# EAGLE design precVref (EAGLE 6.1)
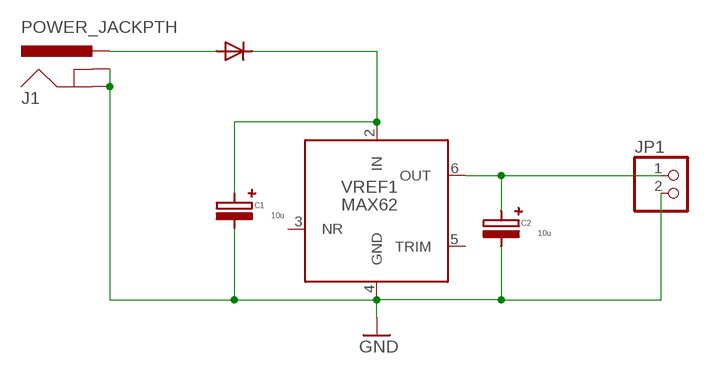
[diagram p0: schematic, sheet 1]

## Parts
C1  10u  C-POL1.5/5  [CPOL1,5/5]
C2  10u  C-POL1.5/5  [CPOL1,5/5]
D1  D7/2X5  [DO-41]
J1  POWER_JACKPTH  [POWER_JACK_PTH]
JP1  PINHD-1X2  [1X02]
VREF1  MAX62  [SOIC-8]

## Nets
GND: C1.P$1(NEG) C2.P$1(NEG) J1.GND J1.GNDBREAK JP1.2 VREF1.4(GND)
N$1: C1.P$2(POS) D1.CATHODE VREF1.2(IN)
N$2: C2.P$2(POS) JP1.1 VREF1.6(OUT)
N$3: D1.ANODE J1.PWR
Unconnected: VREF1.3(NR) VREF1.5(TRIM)

## Library data of the parts
C1 C2 = hightower:C-POL
D1 = hightower:D
J1 = SparkFun:POWER_JACK: Power Jack This is the standard 5.5mm barrel jack for power. The PTH is the most common, proven, reliable, footprint. All others are experimental. The Slot footprint only works if the mill layer is transmitted to the PCB fab house so be warned. Spark Fun Electronics SKU : PRT-00119. Mating wall wart : TOL-00298 (and others)
JP1 = pinhead:PINHD-1X2: PIN HEADER
VREF1 = hightower:MAX62**

## Board
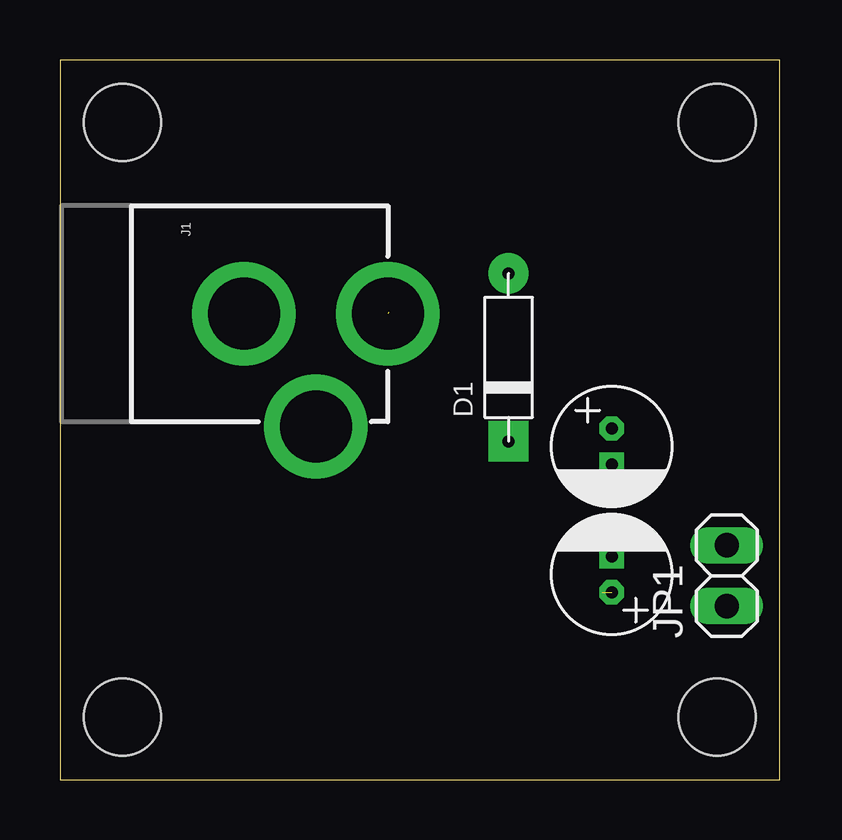
[diagram p1: board, top side]
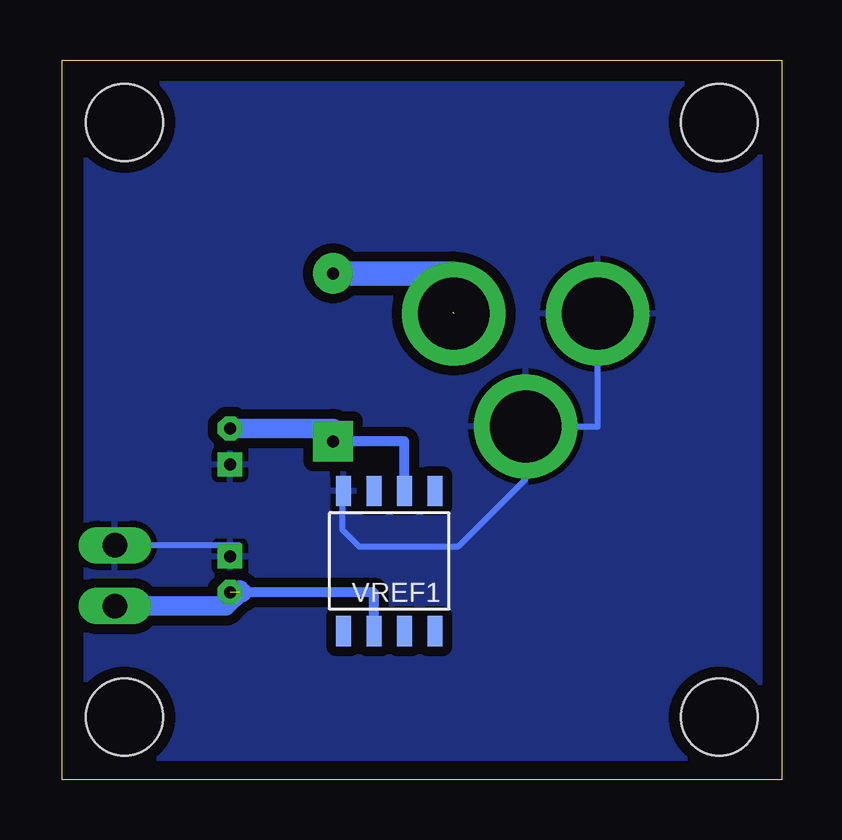
[diagram p2: board, bottom side, seen from below]

Size 30 x 30 mm. Coordinates in mm from the lower left corner, seen from the top.
Outline: 0,0 30,0 30,30 0,30 0,0
Copper layers (1*16): Top 0.035mm / dielectric 1.5mm / Bottom 0.035mm
Design rules: minimum track width 10mil, minimum drill 8mil, track to track 8mil, track to pad 8mil, pad to pad 8mil, via to via 8mil, smd to smd 8mil, copper to edge 20mil, drill to drill 8mil, minimum pad ring 10mil, minimum via ring 8mil, stop-mask expansion 4mil, vias tented up to drill 0mil, thermal gap 10mil
Holes 3.2 mm at 2.6,2.6 27.4,2.6 2.6,27.4 27.4,27.4

### Footprints (pad centres in the part's own frame; a part is rotated, then mirrored left to right if it is on the bottom)
CPOL1,5/5 = drill 0.5 square: P$1 -0.75,0 | drill 0.5 octagon: P$2 0.75,0
DO-41 = drill 0.5 pad 1.676: ANODE 3.5,0 | drill 0.5 pad 1.676 square: CATHODE -3.5,0
POWER_JACK_PTH = drill 2.997 pad 4.318: GND 0,7.7; GNDBREAK 4.7,10.7; PWR 0,13.7
1X02 = drill 1.016 long: 1 -1.27,0; 2 1.27,0
SOIC-8 = smd 0.635 x 1.27: 1 -1.905,-2.921; 2 -0.635,-2.921; 3 0.635,-2.921; 4 1.905,-2.921; 5 1.905,2.921; 6 0.635,2.921; 7 -0.635,2.921; 8 -1.905,2.921

### Placement (x,y rotation side)
C1  23,13.89 90 top
C2  23,8.56 270 top
D1  18.7,17.6 90 top
J1  -0.03,19.42 270 top
JP1  27.8,8.5 90 top
VREF1  MAX62*  [SOIC-8]  16.36,9.11 180 bottom

### Tracks (layer width: path | path; a pad name or v marks a point on that pad's centre or on a via)
GND
  Bottom 0.254: J1.GND 7.67,14.7 10.7,14.7 10.7,12.5 13.5,9.7 17.6,9.7 18.3,10.4 18.3,12 VREF1.4 | C2.P$1 22.62,9.77 JP1.2
  pour Bottom (isolate 0.406): 1,29 29,29 29,0.9 0.9,0.9 0.9,29
N$1
  Bottom 0.406: VREF1.2 15.72,14.1 D1.CATHODE 18.8,14.1
  Bottom 0.813: C1.P$2 18.7,14.64 D1.CATHODE
N$2  (1 unrouted)
  Bottom 0.406: VREF1.6 17,7.8 22.5,7.8 22.6,7.8
  Bottom 0.813: JP1.1 23.17,7.23 22.6,7.8 22.6,7.9 22.5,7.8
N$3  (1 unrouted)
  Bottom 1.016: D1.ANODE 13.7,21.1 13.7,19.5